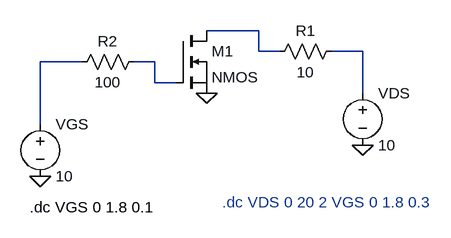
[diagram p0: schematic mosfet.asc]
mosfet.asc, the LTspice schematic file:
Version 4
SHEET 1 880 680
WIRE 304 224 224 224
WIRE 304 256 304 224
WIRE 336 256 304 256
WIRE 464 256 416 256
WIRE 32 272 -32 272
WIRE 144 272 112 272
WIRE 144 304 144 272
WIRE 176 304 144 304
WIRE 464 320 464 256
WIRE -32 368 -32 272
FLAG 224 320 0
FLAG -32 448 0
FLAG 464 400 0
SYMBOL nmos 176 224 R0
SYMATTR InstName M1
SYMBOL res 320 272 R270
WINDOW 0 32 56 VTop 2
WINDOW 3 0 56 VBottom 2
SYMATTR InstName R1
SYMATTR Value 10
SYMBOL res 16 288 R270
WINDOW 0 32 56 VTop 2
WINDOW 3 0 56 VBottom 2
SYMATTR InstName R2
SYMATTR Value 100
SYMBOL voltage 464 304 R0
SYMATTR InstName VDS
SYMATTR Value 10
SYMBOL voltage -32 352 R0
SYMATTR InstName VGS
SYMATTR Value 10
TEXT -48 496 Left 2 !.dc VGS 0 1.8 0.1
TEXT 248 488 Left 2 ;.dc VDS 0 20 2 VGS 0 1.8 0.3

The netlist it stands for:
* mosfet.asc
M1 N001 N004 0 0 NMOS
R1 N001 N002 10
R2 N003 N004 100
VDS N002 0 10
VGS N003 0 10
.model NMOS NMOS
.model PMOS PMOS
.lib standard.mos
.dc VGS 0 1.8 0.1
* .dc VDS 0 20 2 VGS 0 1.8 0.3
.backanno
.end